# EAGLE design touch_buttons (EAGLE 9.2.1)
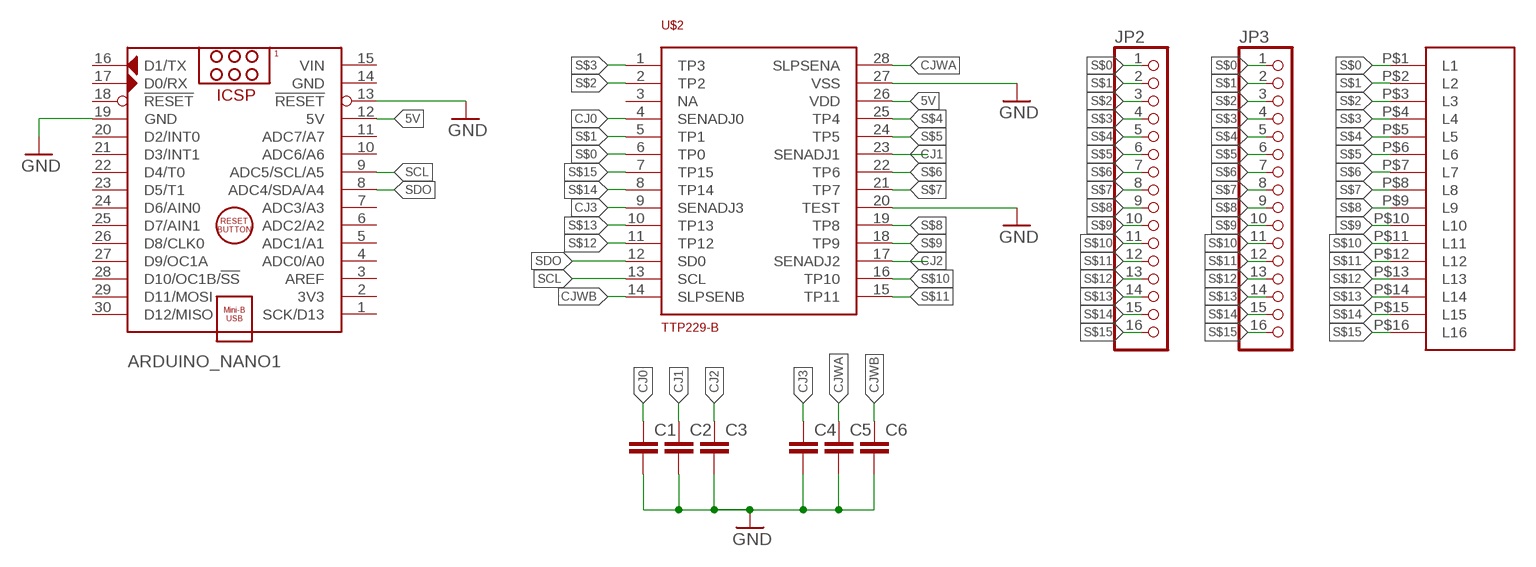
[diagram p0: schematic, sheet 1]

## Parts
ARDUINO_NANO1  ARDUINO_NANO  [ARDUINO_NANO]
C1  1UF-25V-10%(0805)"  [0805-CAP]
C2  1UF-25V-10%(0805)"  [0805-CAP]
C3  1UF-25V-10%(0805)"  [0805-CAP]
C4  1UF-25V-10%(0805)"  [0805-CAP]
C5  1UF-25V-10%(0805)"  [0805-CAP]
C6  1UF-25V-10%(0805)"  [0805-CAP]
JP2  PINHD-1X16  [1X16]
JP3  PINHD-1X16  [1X16]
U$2  TTP229-B  [SSOP28]
U$3  SLIDE_TOUCH_RAR_V1  [SLIDE_TOUCH_BAR_V1]

## Nets
5V: ARDUINO_NANO1.12(5V) U$2.26(VDD)
CJ0: C1.1 U$2.4(SENADJ0)
CJ1: C2.1 U$2.23(SENADJ1)
CJ2: C3.1 U$2.17(SENADJ2)
CJ3: C4.1 U$2.9(SENADJ3)
CJWA: C5.1 U$2.28(SLPSENA)
CJWB: C6.1 U$2.14(SLPSENB)
GND: ARDUINO_NANO1.13(!RESET) ARDUINO_NANO1.19(GND) C1.2 C2.2 C3.2 C4.2 C5.2 C6.2 U$2.20(TEST) U$2.27(VSS)
S$0: JP2.1 JP3.1 U$2.6(TP0) U$3.P$1(L1)
S$1: JP2.2 JP3.2 U$2.5(TP1) U$3.P$2(L2)
S$2: JP2.3 JP3.3 U$2.2(TP2) U$3.P$3(L3)
S$3: JP2.4 JP3.4 U$2.1(TP3) U$3.P$4(L4)
S$4: JP2.5 JP3.5 U$2.25(TP4) U$3.P$5(L5)
S$5: JP2.6 JP3.6 U$2.24(TP5) U$3.P$6(L6)
S$6: JP2.7 JP3.7 U$2.22(TP6) U$3.P$7(L7)
S$7: JP2.8 JP3.8 U$2.21(TP7) U$3.P$8(L8)
S$8: JP2.9 JP3.9 U$2.19(TP8) U$3.P$9(L9)
S$9: JP2.10 JP3.10 U$2.18(TP9) U$3.P$10(L10)
S$10: JP2.11 JP3.11 U$2.16(TP10) U$3.P$11(L11)
S$11: JP2.12 JP3.12 U$2.15(TP11) U$3.P$12(L12)
S$12: JP2.13 JP3.13 U$2.11(TP12) U$3.P$13(L13)
S$13: JP2.14 JP3.14 U$2.10(TP13) U$3.P$14(L14)
S$14: JP2.15 JP3.15 U$2.8(TP14) U$3.P$15(L15)
S$15: JP2.16 JP3.16 U$2.7(TP15) U$3.P$16(L16)
SCL: ARDUINO_NANO1.9(ADC5/SCL/A5) U$2.13(SCL)
SDO: ARDUINO_NANO1.8(ADC4/SDA/A4) U$2.12(SD0)
Unconnected: ARDUINO_NANO1.1(SCK/D13) ARDUINO_NANO1.2(3V3) ARDUINO_NANO1.3(AREF) ARDUINO_NANO1.4(ADC0/A0) ARDUINO_NANO1.5(ADC1/A1) ARDUINO_NANO1.6(ADC2/A2) ARDUINO_NANO1.7(ADC3/A3) ARDUINO_NANO1.10(ADC6/A6) ARDUINO_NANO1.11(ADC7/A7) ARDUINO_NANO1.16(D1/TX) ARDUINO_NANO1.17(D0/RX) ARDUINO_NANO1.18(!RESET) ARDUINO_NANO1.20(D2/INT0) ARDUINO_NANO1.21(D3/INT1) ARDUINO_NANO1.22(D4/T0) ARDUINO_NANO1.23(D5/T1) ARDUINO_NANO1.24(D6/AIN0) ARDUINO_NANO1.25(D7/AIN1) ARDUINO_NANO1.26(D8/CLK0) ARDUINO_NANO1.27(D9/OC1A) ARDUINO_NANO1.28(D10/OC1B/!SS) ARDUINO_NANO1.29(D11/MOSI) ARDUINO_NANO1.30(D12/MISO) U$2.3(NA)

## Power pins joined to a net without a drawn wire
GND: ARDUINO_NANO1.14(GND)
VIN: ARDUINO_NANO1.15(VIN)

## Library data of the parts
ARDUINO_NANO1 = ArduinoNanoV30:ARDUINO_NANO: Arduino Nano V3.0 Module Overview: The Arduino Nano is a small, complete, and breadboard-friendly board based on the ATmega328 (Arduino Nano 3.x) or ATmega168 (Arduino Nano 2.x). It has more or less the same functionality of the Arduino Duemilanove, but in a different package. It lacks only a DC power jack, and works with a Mini-B USB cable instead of a standard one. The Nano was designed and is being produced by Gravitech <http://www.gravitech.us/arna30wiatp.html>. General specifications: Item Value Microcontroller Atmel ATmega168 or ATmega328 Operating Voltage (logic level) 5 V Input Voltage (recommended) 7-12 V Input Voltage (limits) 6-20 V Digital I/O Pins 14 (of which 6 provide PWM output) Analog Input Pins 8 DC Current per I/O Pin 40 mA Flash Memory 16 KB (ATmega168) or 32 KB (ATmega328) of which 2 KB used by bootloader SRAM 1 KB (ATmega168) or 2 KB (ATmega328) EEPROM 512 bytes (ATmega168) or 1 KB (ATmega328) Clock Speed 16 MHz Dimensions (Inches) 0.73" x 1.70" Dimensions (mm) 18mm x 45mm Overall height About 9 mm (not including pins) Weigth 5 g Power: The Arduino Nano can be powered via the Mini-B USB connection, 6-20V unregulated external power supply (pin 30), or 5V regulated external power supply (pin 27). The power source is automatically selected to the highest voltage source. Memory: The ATmega168 has 16 KB of flash memory for storing code (of which 2 KB is used for the bootloader); the ATmega328 has 32 KB, (also with 2 KB used for the bootloader). The ATmega168 has 1 KB of SRAM and 512 bytes of EEPROM (which can be read and written with the EEPROM library); the ATmega328 has 2 KB of SRAM and 1 KB of EEPROM. Input and Output: Each of the 14 digital pins on the Nano can be used as an input or output, using pinMode(), digitalWrite(), and digitalRead() functions. They operate at 5 volts. Each pin can provide or receive a maximum of 40 mA and has an internal pull-up resistor (disconnected by default) of 20-50 kOhms. In addition, some pins have specialized functions. Visit Arduino - ArduinoBoardNano <https://www.arduino.cc/en/Main/ArduinoBoardNano>
C1-C6 = SparkFun-Capacitors:1UF-25V-10%(0805): CAP-08064
JP2 JP3 = pinhead:PINHD-1X16: PIN HEADER
U$2 = azalapa:TTP229-B
U$3 = azalapa:SLIDE_TOUCH_RAR_V1

## Board
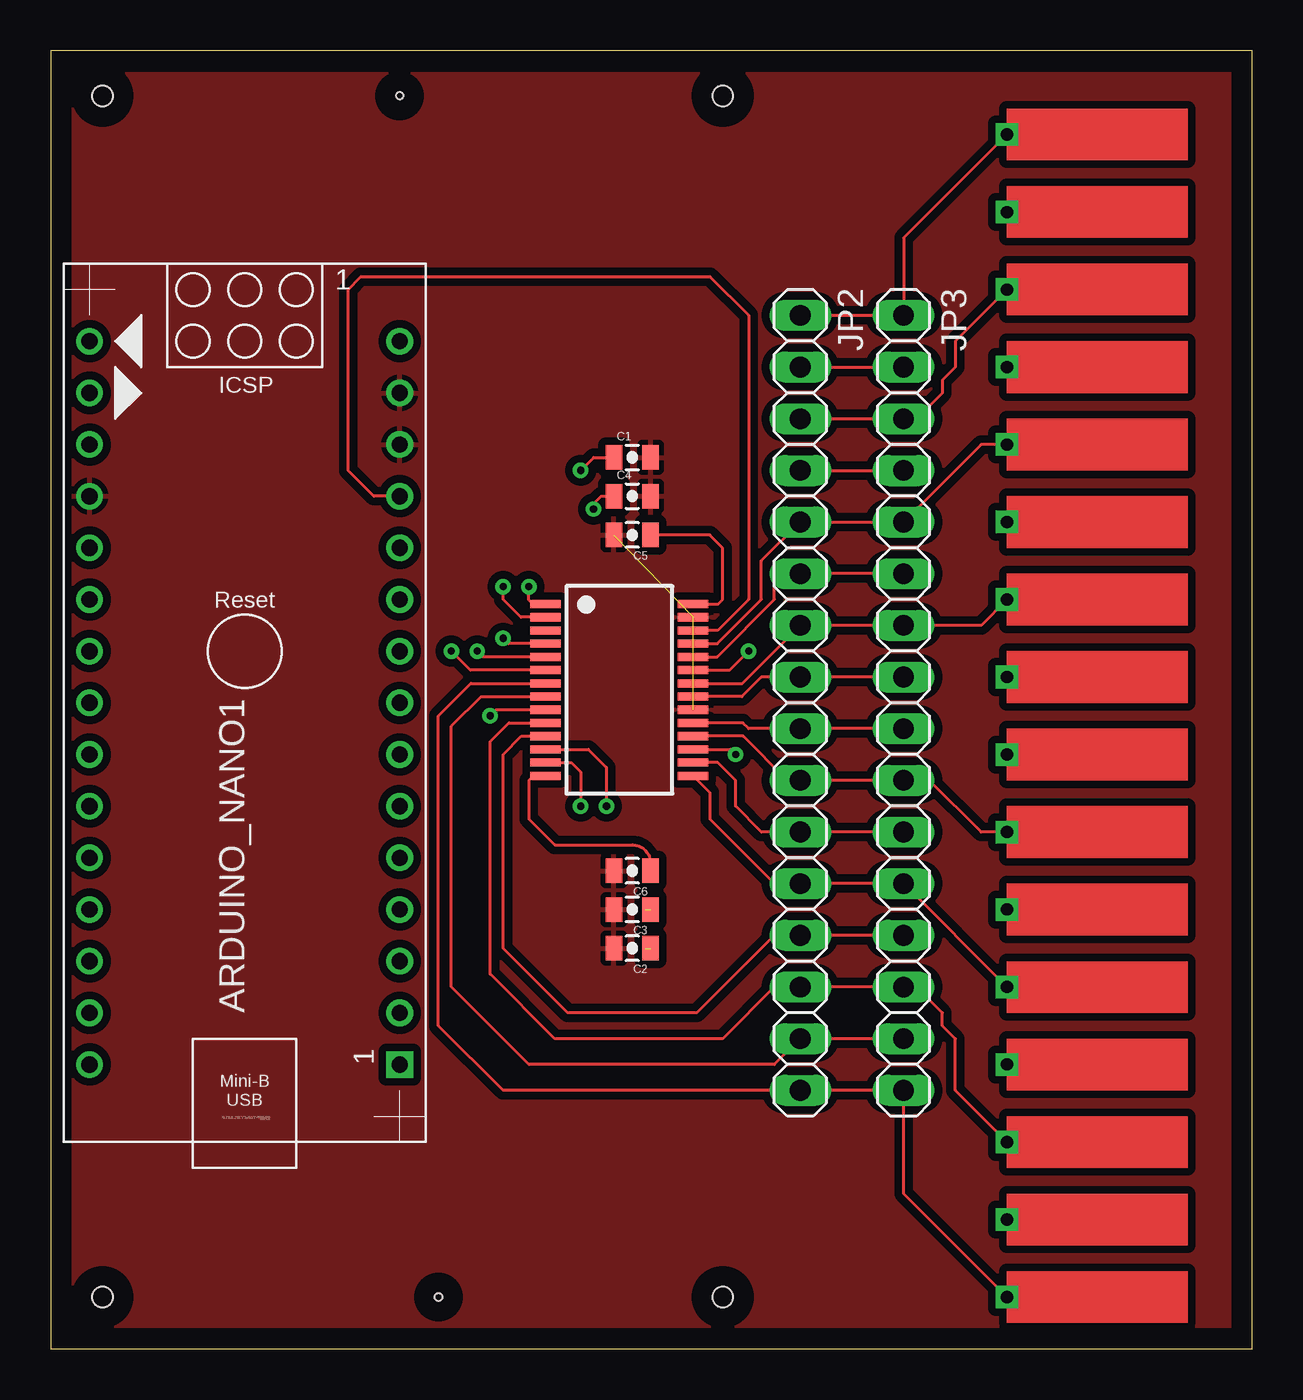
[diagram p1: board, top side]
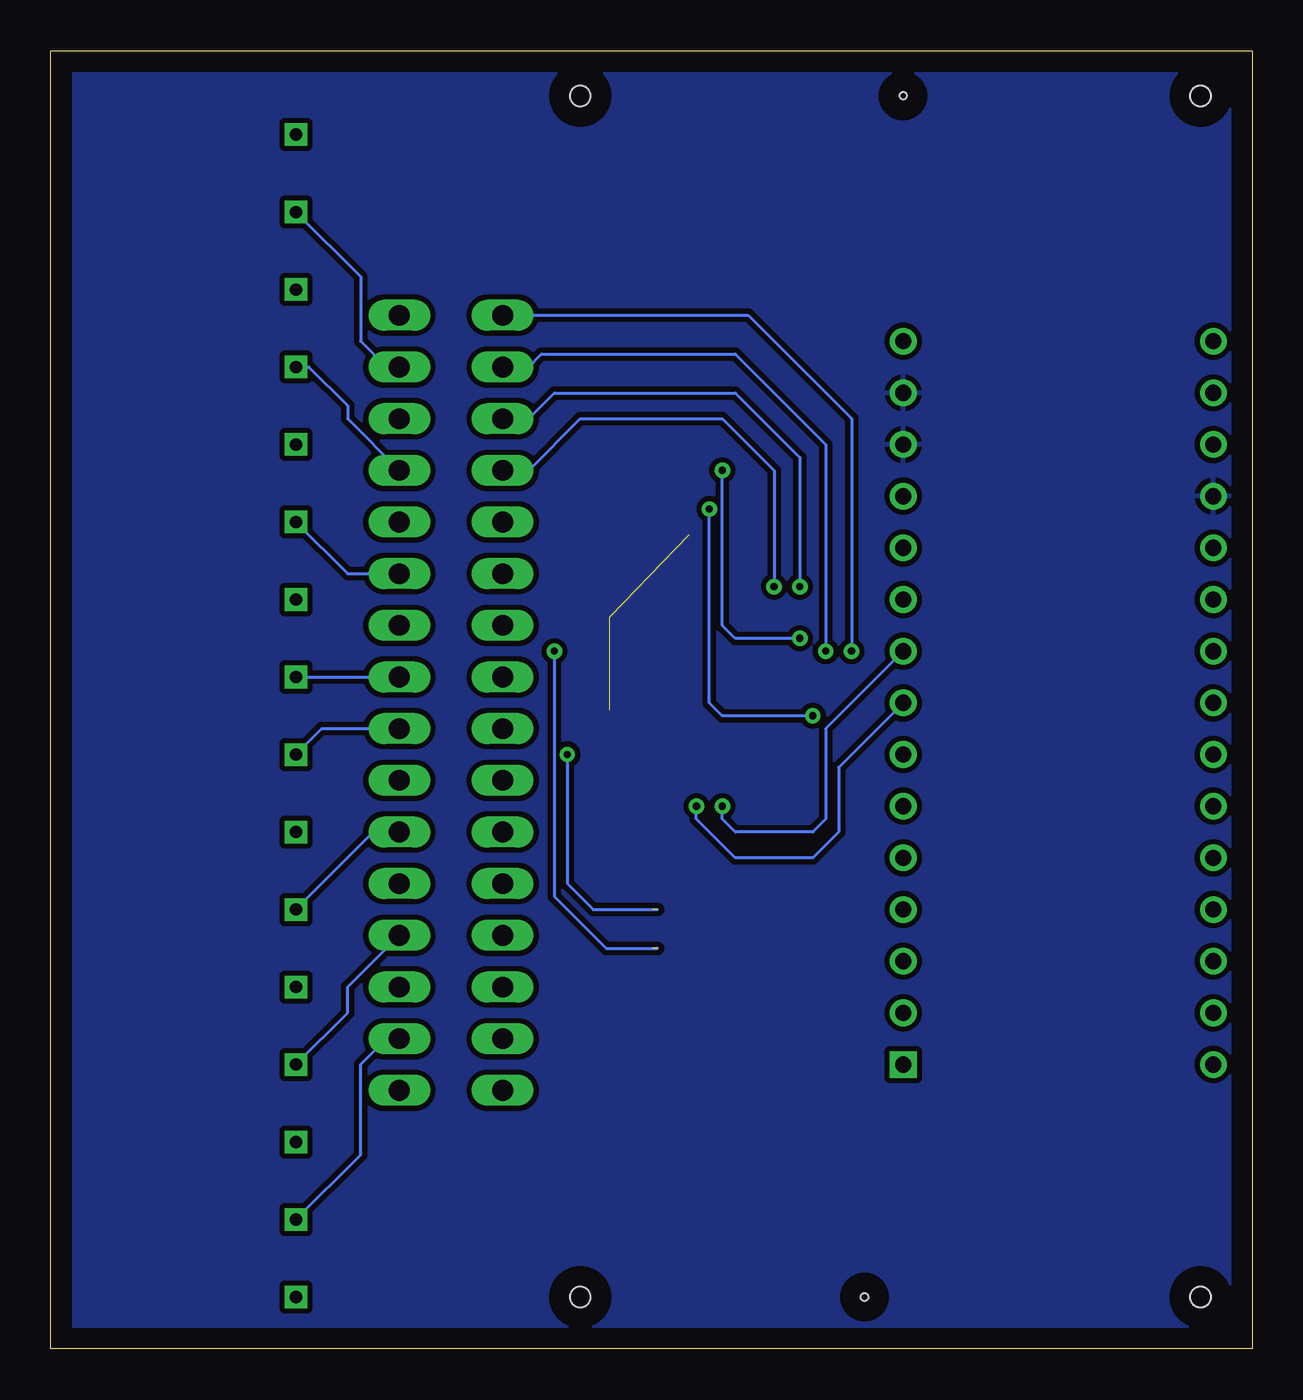
[diagram p2: board, bottom side, seen from below]

Size 59.03 x 63.8 mm. Coordinates in mm from the lower left corner, seen from the top.
Outline: 0,0 59.03,0 59.03,63.8 0,63.8 0,0
Copper layers (1*16): Top 0.035mm / dielectric 1.5mm / Bottom 0.035mm
Design rules "default": minimum track width 6mil, minimum drill 0.35mm, track to track 6mil, track to pad 6mil, pad to pad 6mil, via to via 6mil, smd to smd 6mil, copper to edge 40mil, drill to drill 6mil, minimum pad ring 10mil, minimum via ring 8mil, stop-mask expansion 4mil, vias tented up to drill 0mil, thermal gap 10mil
Holes 1 mm at 2.54,61.59 33.02,61.59 33.02,2.54 2.54,2.54
Holes 0.35 mm at 17.14,61.59 19.05,2.54

### Footprints (pad centres in the part's own frame; a part is rotated, then mirrored left to right if it is on the bottom)
ARDUINO_NANO = drill 0.8 square: 1 -20.32,-7.62 | drill 0.8: 2 -17.78,-7.62; 3 -15.24,-7.62; 4 -12.7,-7.62; 5 -10.16,-7.62; 6 -7.62,-7.62; 7 -5.08,-7.62; 8 -2.54,-7.62; 9 0,-7.62; 10 2.54,-7.62; 11 5.08,-7.62; 12 7.62,-7.62; 13 10.16,-7.62; 14 12.7,-7.62; 15 15.24,-7.62; 16 15.24,7.62; 17 12.7,7.62; 18 10.16,7.62; 19 7.62,7.62; 20 5.08,7.62; 21 2.54,7.62; 22 0,7.62; 23 -2.54,7.62; 24 -5.08,7.62; 25 -7.62,7.62; 26 -10.16,7.62; 27 -12.7,7.62; 28 -15.24,7.62; 29 -17.78,7.62; 30 -20.32,7.62
0805-CAP = smd 0.8 x 1.2: 1 -0.9,0; 2 0.9,0
1X16 = drill 1.016 long: 1 -19.05,0; 2 -16.51,0; 3 -13.97,0; 4 -11.43,0; 5 -8.89,0; 6 -6.35,0; 7 -3.81,0; 8 -1.27,0; 9 1.27,0; 10 3.81,0; 11 6.35,0; 12 8.89,0; 13 11.43,0; 14 13.97,0; 15 16.51,0; 16 19.05,0
SSOP28 = smd 0.4 x 1.5: 1 -4.225,-3.625; 2 -3.575,-3.625; 3 -2.925,-3.625; 4 -2.275,-3.625; 5 -1.625,-3.625; 6 -0.975,-3.625; 7 -0.325,-3.625; 8 0.325,-3.625; 9 0.975,-3.625; 10 1.625,-3.625; 11 2.275,-3.625; 12 2.925,-3.625; 13 3.575,-3.625; 14 4.225,-3.625; 15 4.225,3.625; 16 3.575,3.625; 17 2.925,3.625; 18 2.275,3.625; 19 1.625,3.625; 20 0.975,3.625; 21 0.325,3.625; 22 -0.325,3.625; 23 -0.975,3.625; 24 -1.625,3.625; 25 -2.275,3.625; 26 -2.925,3.625; 27 -3.575,3.625; 28 -4.225,3.625
SLIDE_TOUCH_BAR_V1 = drill 0.6 square: P$1 -1.27,29.21; P$2 -1.27,25.4; P$3 -1.27,21.59; P$4 -1.27,17.78; P$5 -1.27,13.97; P$6 -1.27,10.16; P$7 -1.27,6.35; P$8 -1.27,2.54; P$9 -1.27,-1.27; P$10 -1.27,-5.08; P$11 -1.27,-8.89; P$12 -1.27,-12.7; P$13 -1.27,-16.51; P$14 -1.27,-20.32; P$15 -1.27,-24.13; P$16 -1.27,-27.94

### Placement (x,y rotation side)
ARDUINO_NANO1  9.53,34.29 90 top
C1  28.57,43.81 0 top
C2  28.57,19.68 180 top
C3  28.57,21.59 180 top
C4  28.57,41.91 0 top
C5  28.57,40.01 180 top
C6  28.57,23.5 180 top
JP2  36.83,31.75 270 top
JP3  41.91,31.75 270 top
U$2  27.94,32.38 270 top
U$3  48.26,30.48 0 top

### Tracks (layer width: path | path; a pad name or v marks a point on that pad's centre or on a via)
5V
  Top 0.152: ARDUINO_NANO1.12 15.88,41.91 14.61,43.18 14.61,52.07 15.24,52.7 32.38,52.7 34.29,50.8 34.29,36.83 32.77,35.31 U$2.26
CJ0  (via drill 0.35)
  Top 0.152: U$2.4 22.49,34.66 v22.23,34.92 | v26.04,43.18 26.67,43.81 C1.1
  Bottom 0.152: v22.23,34.92 25.4,34.92 26.04,35.56 v26.04,43.18
CJ1  (via drill 0.35)  (1 unrouted)
  Top 0.152: U$2.23 33.36,33.36 v34.29,34.29
  Bottom 0.152: 29.21,19.68 31.75,19.68 34.29,22.23 v34.29,34.29
CJ2  (via drill 0.35)  (1 unrouted)
  Top 0.152: v33.66,29.21 33.41,29.46 U$2.17
  Bottom 0.152: v33.66,29.21 33.66,22.86 32.38,21.59 29.21,21.59
CJ3  (via drill 0.35)
  Top 0.152: U$2.9 21.89,31.41 v21.59,31.11 | v26.67,41.27 26.67,41.54 27.04,41.91 C4.1
  Bottom 0.152: v21.59,31.11 26.04,31.11 26.67,31.75 v26.67,41.27
CJWA
  Top 0.152: U$2.28 32.8,36.61 33.02,36.83 33.02,39.37 32.38,40.01 C5.1
CJWB
  Top 0.152: U$2.14 23.71,28.16 23.5,27.94 23.5,26.04 24.77,24.77 28.57,24.77 arc-90 29.48,23.86 C6.1
GND  (2 unrouted)
  pour Top (isolate 0.381): 0,0 0,62.87 53.98,62.87 58.42,62.87 58.42,0
  pour Bottom (isolate 0.254): 0,0 58.42,0 58.42,62.87 0,62.87 0,60.33
S$0  (via drill 0.35)
  Top 0.152: U$3.P$1 41.91,54.61 JP3.1 JP2.1 | U$2.6 20.61,33.36 v19.68,34.29
  Bottom 0.152: JP2.1 24.77,50.8 19.68,45.72 v19.68,34.29
S$1  (via drill 0.35)
  Top 0.152: JP2.2 JP3.2 | U$2.5 21.23,34.01 v20.95,34.29
  Bottom 0.152: U$3.P$2 43.81,52.7 43.81,49.53 42.55,48.26 JP3.2 | JP2.2 35.56,48.26 34.92,48.9 25.4,48.9 20.95,44.45 v20.95,34.29
S$2  (via drill 0.35)
  Top 0.152: U$3.P$3 44.45,49.53 44.45,48.26 43.81,47.62 43.81,46.99 42.55,45.72 JP3.3 JP2.3 | U$2.2 23.09,35.96 22.23,36.83 v22.23,37.47
  Bottom 0.152: JP2.3 35.56,45.72 34.29,46.99 25.4,46.99 22.23,43.81 v22.23,37.47
S$3  (via drill 0.35)
  Top 0.152: JP2.4 JP3.4 | U$2.1 23.68,36.61 23.5,36.8 v23.5,37.47
  Bottom 0.152: U$3.P$4 46.35,48.26 44.45,46.35 44.45,45.72 JP3.4 | JP2.4 35.56,43.18 33.02,45.72 26.04,45.72 23.5,43.18 v23.5,37.47
S$4
  Top 0.152: U$3.P$5 45.72,44.45 JP3.5 JP2.5 34.92,38.73 34.92,36.83 32.76,34.66 U$2.25
S$5
  Top 0.152: JP3.6 JP2.6 36.2,38.1 35.56,37.47 35.56,36.83 32.74,34.01 U$2.24
  Bottom 0.152: U$3.P$6 44.45,38.1 JP3.6
S$6
  Top 0.152: U$3.P$7 45.72,35.56 JP3.7 JP2.7 33.98,32.71 U$2.22
S$7
  Top 0.152: JP3.8 JP2.8 34.92,33.02 33.97,32.06 U$2.21
  Bottom 0.152: U$3.P$8 JP3.8
S$8
  Top 0.152: JP3.9 JP2.9 34.29,30.48 34.01,30.76 U$2.19
  Bottom 0.152: U$3.P$9 45.72,30.48 JP3.9
S$9
  Top 0.152: U$3.P$10 45.72,25.4 43.18,27.94 JP3.10 JP2.10 36.2,27.94 34.02,30.11 U$2.18
S$10
  Top 0.152: JP3.11 JP2.11 34.92,25.4 33.66,26.67 33.66,27.94 32.78,28.81 U$2.16
  Bottom 0.152: U$3.P$11 43.18,25.4 JP3.11
S$11
  Top 0.152: U$3.P$12 JP3.12 JP2.12 35.56,22.86 32.38,26.04 32.38,27.34 U$2.15
S$12
  Top 0.152: JP3.13 JP2.13 35.56,20.32 31.75,16.51 25.4,16.51 22.23,19.68 22.23,29.21 23.12,30.11 U$2.11
  Bottom 0.152: U$3.P$13 44.45,16.51 44.45,17.78 JP3.13
S$13
  Top 0.152: U$3.P$14 44.45,12.7 44.45,15.24 43.81,15.88 43.81,16.51 42.55,17.78 JP3.14 JP2.14 35.56,17.78 33.02,15.24 24.77,15.24 21.59,18.41 21.59,29.84 22.5,30.76 U$2.10
S$14
  Top 0.152: JP3.15 JP2.15 35.56,13.97 23.5,13.97 19.68,17.78 19.68,30.61 21.14,32.06 U$2.8
  Bottom 0.152: U$3.P$15 43.81,9.53 43.81,13.97 42.55,15.24 JP3.15
S$15
  Top 0.152: U$3.P$16 41.91,7.62 JP3.16 JP2.16 22.23,12.7 19.05,15.88 19.05,31.11 20.64,32.71 U$2.7
SCL  (via drill 0.35)
  Top 0.152: U$2.13 25.59,28.81 26.04,28.36 v26.04,26.67
  Bottom 0.152: ARDUINO_NANO1.9 20.95,30.48 20.95,26.04 21.59,25.4 25.4,25.4 26.04,26.04 v26.04,26.67
SDO  (via drill 0.35)
  Top 0.152: U$2.12 26.42,29.46 27.3,28.57 v27.3,26.67
  Bottom 0.152: ARDUINO_NANO1.8 20.32,28.57 20.32,25.4 21.59,24.13 25.4,24.13 27.3,26.04 v27.3,26.67